# EAGLE design openSX70_WIP_NEW_LAYOUT_20171229_V30_manually-routed-AR (EAGLE 8.5.1)
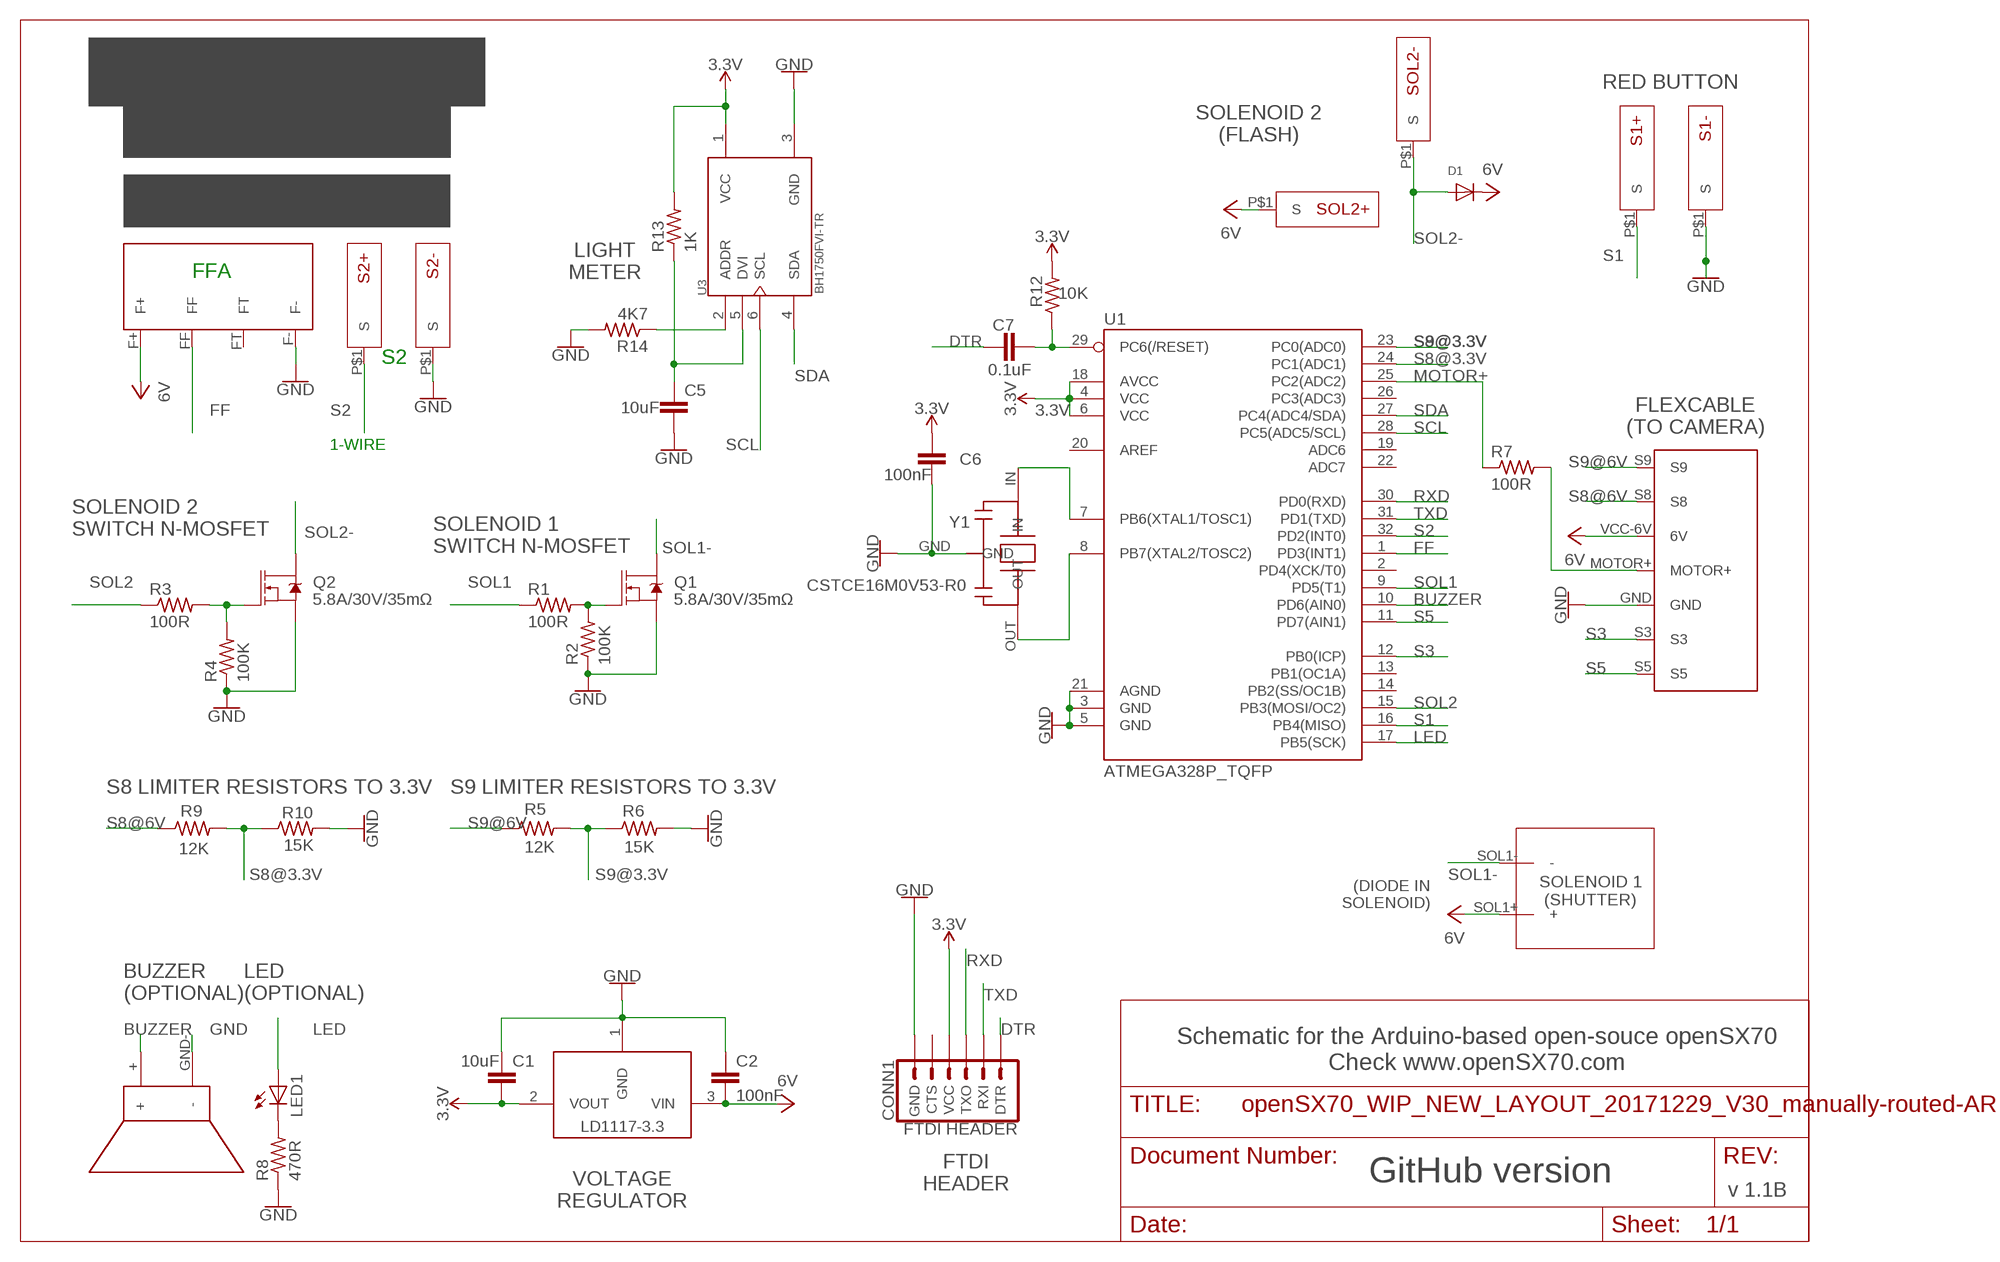
[diagram p0: schematic, sheet 1]

## Parts
BUZZ1  CSET8-5G  [CSET8-5G_PACKAGE]
C1  10uF  10UF-0603-6.3V-20%  [0603]
C2  100nF  C-EUC0603K  [C0603K]
C5  10uF  10UF-0603-6.3V-20%  [0603]
C6  100nF  C-EUC0805  [C0805]
C7  0.1uF  0.1UF-0603-25V-(+80/-20%)  [0603]
CONN1  FTDI HEADER  6_PIN_SERIAL_TARGET  [1X06]
D1  DIODESOD-523  [SOD-523]
LD11173.3V  LD1117 3.3V  LD1117-3.3  [SOT223]
LED1  LEDCHIPLED_0805  [CHIPLED_0805]
Q1  5.8A/30V/35mΩ  MOSFET-NCH-AO3404A  [SOT23-3]
Q2  5.8A/30V/35mΩ  MOSFET-NCH-AO3404A  [SOT23-3]
R1  100R  R-US_R0603  [R0603]
R2  100K  R-US_R0603  [R0603]
R3  100R  R-US_R0603  [R0603]
R4  100K  R-US_R0603  [R0603]
R5  12K  R-US_R0603  [R0603]
R6  15K  R-US_R0603  [R0603]
R7  100R  R-US_R0603  [R0603]
R8  470R  R-US_R0603  [R0603]
R9  12K  R-US_R0603  [R0603]
R10  15K  R-US_R0603  [R0603]
R12  10K  R-US_R0603  [R0603]
R13  1K  R-US_R0603  [R0603]
R14  4K7  R-US_R0603  [R0603]
S1+  SX70_S-PAD  [SX70-S-PAD]
S1-  SX70_S-PAD  [SX70-S-PAD]
S2+  SX70_S-PAD  [SX70-S-PAD]
S2-  SX70_S-PAD  [SX70-S-PAD]
SOL1  SX70-SOLENOID1-2PADS  [SX70-SOLENOID1-2]
SOL2+  SX70_S-PAD  [SX70-S-PAD]
SOL2-  SX70_S-PAD  [SX70-S-PAD]
U1  ATMEGA328P_TQFP  [TQFP32-08]
U3  BH1750FVI-TR  [SOTFL50P300X75-6N]
U$1  SX70-7-PAD  [SX70-7-PAD]
U$2  FFA  SX70-FFA-PAD  [FFA-PAD-PACKAGE]
Y1  CSTCE16M0V53-R0  [CFP95P160X100-3N]

## Nets
3.3V: C1.2 C6.1 CONN1.4(VCC) LD11173.3V.2(VOUT) R12.2 R13.2 U1.4(VCC) U1.6(VCC) U1.18(AVCC) U3.1(VCC)
6V: C2.2 D1.K(C) LD11173.3V.3(VIN) SOL1.SOL1+(+) SOL2+.P$1(S) U$1.VCC-6V(6V) U$2.F+
BUZZER: BUZZ1.+ U1.10(PD6(AIN0))
DTR: C7.1 CONN1.1(DTR)
FF: U1.1(PD3(INT1)) U$2.FF
GND: BUZZ1.GND-(-) C1.1 C2.1 C5.2 C6.2 CONN1.6(GND) LD11173.3V.1(GND) Q1.2(S) Q2.2(S) R2.1 R4.1 R6.2 R8.1 R10.2 R14.2 S1-.P$1(S) S2-.P$1(S) U1.3(GND) U1.5(GND) U1.21(AGND) U3.3(GND) U$1.GND U$2.F- Y1.GND
LED: LED1.A U1.17(PB5(SCK))
MOTOR+: R7.1 U1.25(PC2(ADC2))
MOTOR-HEADER: R7.2 U$1.MOTOR+
N$1: Q1.1(G) R1.2 R2.2
N$2: C5.1 R13.1 U3.5(DVI)
N$3: Q2.1(G) R3.2 R4.2
N$4: U1.7(PB6(XTAL1/TOSC1)) Y1.IN
N$5: LED1.C R8.2
N$6: U1.8(PB7(XTAL2/TOSC2)) Y1.OUT
N$9: C7.2 R12.1 U1.29(PC6(/RESET))
N$10: R14.1 U3.2(ADDR)
RXD: CONN1.3(TXO) U1.30(PD0(RXD))
S1: S1+.P$1(S) U1.16(PB4(MISO))
S2: S2+.P$1(S) U1.32(PD2(INT0))
S3: U1.12(PB0(ICP)) U$1.S3
S5: U1.11(PD7(AIN1)) U$1.S5
S8@3.3V: R9.2 R10.1 U1.24(PC1(ADC1))
S8@6V: R9.1 U$1.S8
S9@3.3V: R5.2 R6.1 U1.23(PC0(ADC0))
S9@6V: R5.1 U$1.S9
SCL: U1.28(PC5(ADC5/SCL)) U3.6(SCL)
SDA: U1.27(PC4(ADC4/SDA)) U3.4(SDA)
SOL1: R1.1 U1.9(PD5(T1))
SOL1-: Q1.3(D) SOL1.SOL1-(-)
SOL2: R3.1 U1.15(PB3(MOSI/OC2))
SOL2-: D1.A Q2.3(D) SOL2-.P$1(S)
TXD: CONN1.2(RXI) U1.31(PD1(TXD))
Unconnected: CONN1.5(CTS) U1.2(PD4(XCK/T0)) U1.13(PB1(OC1A)) U1.14(PB2(SS/OC1B)) U1.19(ADC6) U1.20(AREF) U1.22(ADC7) U1.26(PC3(ADC3)) U$2.FT

## Notes on the sheet
- RED BUTTON
- openSX70 DONGLE
  or
  FLASH
- SOLENOID 2
  (FLASH)
- SX70 DISTRIBUTOR
- LIGHT
  METER
- FFA
- S2
- FLEXCABLE
  (TO CAMERA)
- 1-WIRE
- SOLENOID 2
  SWITCH N-MOSFET
- SOLENOID 1
  SWITCH N-MOSFET
- S8 LIMITER RESISTORS TO 3.3V | S9 LIMITER RESISTORS TO 3.3V
- (DIODE IN
  SOLENOID)
- SOLENOID 1
  (SHUTTER)
- BUZZER
  (OPTIONAL)
- LED
  (OPTIONAL)
- Schematic for the Arduino-based open-souce openSX70
  Check www.openSX70.com
- FTDI
  HEADER
- GitHub version
- VOLTAGE
  REGULATOR
- v 1.1B

## Library data of the parts
BUZZ1 = CSET8-5G_B:CSET8-5G
C1 C5 = SparkFun-Capacitors:10UF: 10.0µF ceramic capacitors A capacitor is a passive two-terminal electrical component used to store electrical energy temporarily in an electric field.; PROD_ID: CAP-11015
C2 = rcl:C-EU: CAPACITOR, European symbol; SPICEPREFIX: C
C6 = resistor:C-EU: CAPACITOR, European symbol
C7 = SparkFun-Capacitors:0.1UF: 0.1µF ceramic capacitors A capacitor is a passive two-terminal electrical component used to store electrical energy temporarily in an electric field.; PROD_ID: CAP-00810
CONN1 = SparkFun-Connectors:6_PIN_SERIAL_TARGET: 6-pin header connection for use with the "FTDI BASIC" pinout - TARGET SIDE. Also known as "Arduino Serial Program Header". It is used to mate with our FTDI Basic serial programmers using the Arduino IDE. Note, this device has "TARGET" in the name. It is intended to be used on a design that contains a target micro-controller that you wish to program. The "sister" device, named "CABLE" is inteneded to be used on a design that usually lives on the end of your USB cable and prvides the converter chip (FTDI232 or FTDI231x) to commnicate serial RX/TX. You can populate with some of these: Break Away Headers - Straight <https://www.sparkfun.com/products/116> (PRT-00116) For reference (or to suit your programming needs) check out these designs: SparkFun FTDI Basic Breakout - 5V <https://www.sparkfun.com/products/9716> (DEV-09716) SparkFun FTDI Basic Breakout - 3.3V <https://www.sparkfun.com/products/9873> (DEV-09873) SparkFun FTDI SmartBasic <https://www.sparkfun.com/products/12935> (DEV-12935) SparkFun Beefy 3 - FTDI Basic Breakout <https://www.sparkfun.com/products/13746> (DEV-13746)
D1 = adafruit:DIODE: Diode SMADIODE - SMA Surface Mount Package 20V 1A Schottky Diode Digikey: 641-1014-6-ND DO-1N4148 - Through Hole Small Current Diode SOD-123 20V 1 A (.5mV Vf) Schottky Diode - Digikey: MBRX120TPMSCT-ND SOD-323 10V 570mA (.38mV Vf, 3ns) Schottky Diode - Digikey: ZLLS410CT-ND SOD-523 30V 30mA Schottky Diode (RB751S-40TE61) - Digikey: RB751S-40TE61CT-ND SOT23-R/W - SOT23 Package (R = Solder Paste/Reflow Ovens, W = Hand-Soldering) BAT54Film 40V 300mA - Digikey: 497-7162-1-ND
LD11173.3V = openSX70:LD1117-3.3; AVAILABILITY: Unavailable; DESCRIPTION: Sot223/Pkg 1-Amp 5-Volt Low Drop Out Voltage Regulatator; MF: Advanced Monolithic Systems; MP: AMS1117-5.0; PACKAGE: None; PRICE: None
LED1 = led:LED: LED OSRAM: - CHIPLED LG R971, LG N971, LY N971, LG Q971, LY Q971, LO R971, LY R971 LH N974, LH R974 LS Q976, LO Q976, LY Q976 LO Q996 - Hyper CHIPLED LW Q18S LB Q993, LB Q99A, LB R99A - SideLED LS A670, LO A670, LY A670, LG A670, LP A670 LB A673, LV A673, LT A673, LW A673 LH A674 LY A675 LS A676, LA A676, LO A676, LY A676, LW A676 LS A679, LY A679, LG A679 - Hyper Micro SIDELED® LS Y876, LA Y876, LO Y876, LY Y876 LT Y87S - SmartLED LW L88C, LW L88S LB L89C, LB L89S, LG L890 LS L89K, LO L89K, LY L89K LS L896, LA L896, LO L896, LY L896 - TOPLED LS T670, LO T670, LY T670, LG T670, LP T670 LSG T670, LSP T670, LSY T670, LOP T670, LYG T670 LG T671, LOG T671, LSG T671 LB T673, LV T673, LT T673, LW T673 LH T674 LS T676, LA T676, LO T676, LY T676, LB T676, LH T676, LSB T676, LW T676 LB T67C, LV T67C, LT T67C, LS T67K, LO T67K, LY T67K, LW E67C LS E67B, LA E67B, LO E67B, LY E67B, LB E67C, LV E67C, LT E67C LW T67C LS T679, LY T679, LG T679 LS T770, LO T770, LY T770, LG T770, LP T770 LB T773, LV T773, LT T773, LW T773 LH T774 LS E675, LA E675, LY E675, LS T675 LS T776, LA T776, LO T776, LY T776, LB T776 LHGB T686 LT T68C, LB T68C - Hyper Mini TOPLED® LB M676 - Mini TOPLED Santana® LG M470 LS M47K, LO M47K, LY M47K Source: http://www.osram.convergy.de LUXEON: - LUMILED® LXK2-PW12-R00, LXK2-PW12-S00, LXK2-PW14-U00, LXK2-PW14-V00 LXK2-PM12-R00, LXK2-PM12-S00, LXK2-PM14-U00 LXK2-PE12-Q00, LXK2-PE12-R00, LXK2-PE12-S00, LXK2-PE14-T00, LXK2-PE14-U00 LXK2-PB12-K00, LXK2-PB12-L00, LXK2-PB12-M00, LXK2-PB14-N00, LXK2-PB14-P00, LXK2-PB14-Q00 LXK2-PR12-L00, LXK2-PR12-M00, LXK2-PR14-Q00, LXK2-PR14-R00 LXK2-PD12-Q00, LXK2-PD12-R00, LXK2-PD12-S00 LXK2-PH12-R00, LXK2-PH12-S00 LXK2-PL12-P00, LXK2-PL12-Q00, LXK2-PL12-R00 Source: www.luxeon.com KINGBRIGHT: KA-3528ASYC Source: www.kingbright.com
Q1 Q2 = openSX70:MOSFET-NCH: N-channel MOSFETs Voltage controlled devices that allow control of high current outputs. SparkFun Products: SparkFun OpenScale <https://www.sparkfun.com/products/13261> SparkFun Digital Sandbox <https://www.sparkfun.com/products/12651> SparkFun Monster Moto Shield <https://www.sparkfun.com/products/10182> SparkFun MOSFET Power Controller <https://www.sparkfun.com/products/11214>; PROD_ID: TRANS-12988
R1-R10 R12-R14 = resistor:R-US_: RESISTOR, American symbol
S1+ S1- S2+ S2- SOL2+ SOL2- = openSX70:SX70_S-PAD
SOL1 = openSX70:SX70-SOLENOID1-2PADS
U1 = openSX70:ATMEGA328P_TQFP: Popular 328P in QFP Storefront component: ATmega328 - TQFP <https://www.sparkfun.com/products/13448> (COM-13448) Datasheet <http://www.sparkfun.com/datasheets/Components/SMD/ATMega328.pdf> SparkFun Products SparkFun RedBoard - Programmed with Arduino <https://www.sparkfun.com/products/12757> (DEV-12757) Arduino Pro Mini 328 - 5V/16MHz <https://www.sparkfun.com/products/11113> (DEV-11113) Arduino Pro Mini 328 - 3.3V/8MHz <https://www.sparkfun.com/products/11114> (DEV-11114) SparkFun OpenLog <https://www.sparkfun.com/products/13712> (DEV-13712) SparkFun MicroView - OLED Arduino Module <https://www.sparkfun.com/products/12923> (DEV-12923) SparkFun Digital Sandbox <https://www.sparkfun.com/products/12651> (DEV-12651) SparkFun PicoBoard <https://www.sparkfun.com/products/11888> (WIG-11888) Arduino Fio <https://www.sparkfun.com/products/10116> (DEV-10116) LilyPad Arduino 328 Main Board <https://www.sparkfun.com/products/13342> (DEV-13342) SparkFun RedStick <https://www.sparkfun.com/products/13741> (DEV-13741) LilyPad MP3 <https://www.sparkfun.com/products/11013> (DEV-11013) LilyPad Arduino SimpleSnap <https://www.sparkfun.com/products/10941> (DEV-10941) SparkFun Stepoko <https://www.sparkfun.com/products/13899> (ROB-13899) SparkFun Geiger Counter <https://www.sparkfun.com/products/11345> (SEN-11345) SparkFun EL Sequencer <https://www.sparkfun.com/products/12781> (COM-12781) Arduino Pro 328 - 5V/16MHz <https://www.sparkfun.com/products/10915> (DEV-10915) CryptoCape <https://www.sparkfun.com/products/12773> (DEV-12773) SparkFun IR Thermometer Evaluation Board - MLX90614 <https://www.sparkfun.com/products/10740> (SEN-10740) SparkFun RedBot Mainboard <https://www.sparkfun.com/products/12097> (ROB-12097) Arduino Pro 328 - 3.3V/8MHz <https://www.sparkfun.com/products/10914> (DEV-10914) SparkFun Block for Intel® Edison - Arduino <https://www.sparkfun.com/products/13036> (DEV-13036) SparkFun Simon Says - Surface Mount Soldering Kit <https://www.sparkfun.com/products/10935> (KIT-10935) SparkFun 7-Segment Serial Display - Red <https://www.sparkfun.com/products/11441> (COM-11441) SparkFun 7-Segment Serial Display - White <https://www.sparkfun.com/products/11629> (COM-11629) SparkFun 7-Segment Serial Display - Yellow <https://www.sparkfun.com/products/11443> (COM-11443) SparkFun 7-Segment Serial Display - Kelly Green <https://www.sparkfun.com/products/11440> (COM-11440) SparkFun 7-Segment Serial Display - Blue <https://www.sparkfun.com/products/11442> (COM-11442) SparkFun OpenSegment Serial Display - 20mm (Blue) <https://www.sparkfun.com/products/11647> (COM-11647) SparkFun OpenSegment Serial Display - 20mm (Green) <https://www.sparkfun.com/products/11646> (COM-11646) SparkFun OpenSegment Serial Display - 20mm (White) <https://www.sparkfun.com/products/11648> (COM-11648) SparkFun OpenSegment Serial Display - 20mm (Red) <https://www.sparkfun.com/products/11644> (COM-11644) SparkFun OpenSegment Serial Display - 20mm (Yellow) <https://www.sparkfun.com/products/11645> (COM-11645) SparkFun OpenSegment Shield <https://www.sparkfun.com/products/13190> (DEV-13190); PROD_ID: IC-09069
U3 = openSX70:BH1750FVI-TR: Light to Digital Ambient Light Sensor Digital O/P 1lux to 65535lux 6-Pin WSOF Embossed T/R; AVAILABILITY: Good; DESCRIPTION: Light to Digital Ambient Light Sensor Digital O/P 1lux to 65535lux 6-Pin WSOF Embossed T/R; MF: Rohm; MP: BH1750FVI-TR; PACKAGE: SMD-6 Rohm; PRICE: 2.38 USD
U$1 = openSX70:SX70-7-PAD
U$2 = openSX70:SX70-FFA-PAD
Y1 = CSTCE16M0V53-R0:CSTCE16M0V53-R0: Ceramic Resonator 16MHz ±0.5% (Tol) ±0.3% (Stability) 15pF 40Ohm 3-Pin CSMD T/R; AVAILABILITY: Good; DESCRIPTION: Ceramic Resonator 16MHz ??0.5% (Tol) ??0.3% (Stability) 15pF 40Ohm 3-Pin CSMD T/R; MF: Murata; MP: CSTCE16M0V53-R0; PACKAGE: SMD-3 Murata; PRICE: 0.28 USD

## Board
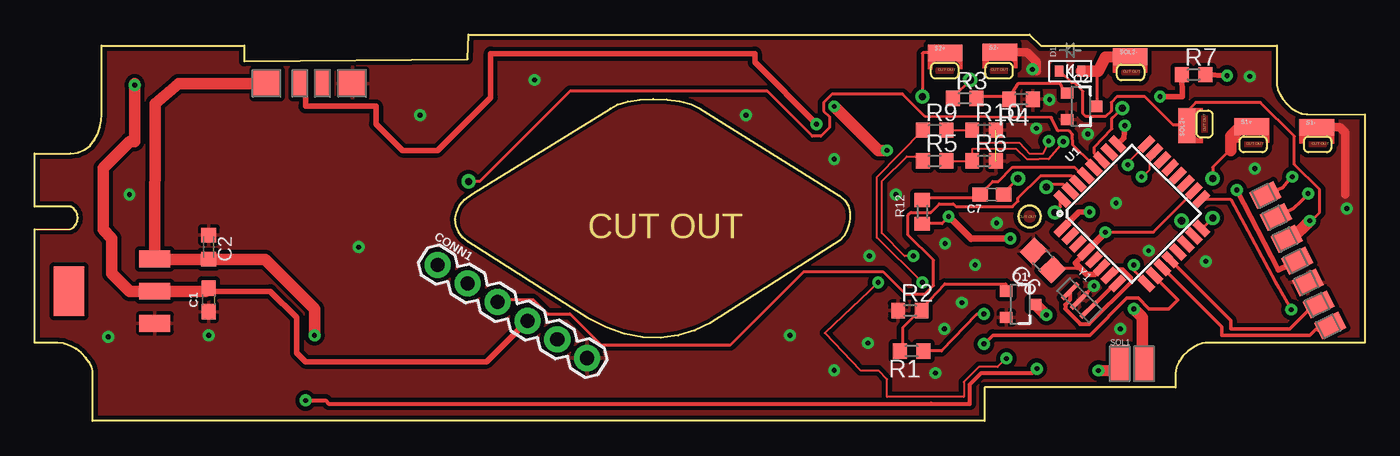
[diagram p1: board, top side]
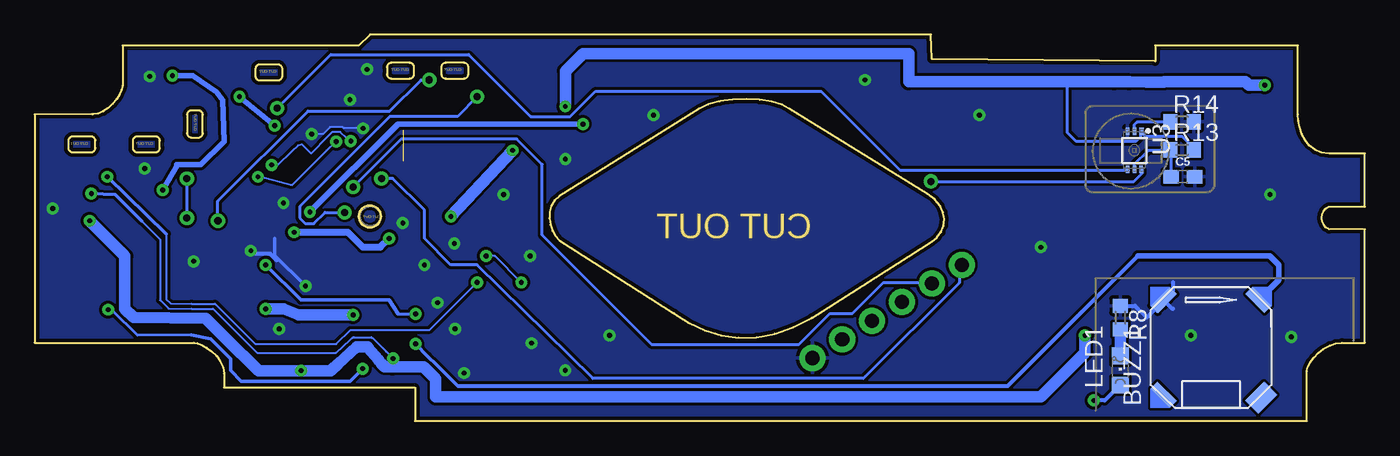
[diagram p2: board, bottom side, seen from below]

Size 95.88 x 27.86 mm. Coordinates in mm from the lower left corner, seen from the top.
Outline: 71.72,15.54 71.88,15.53 72.03,15.48 72.17,15.41 72.29,15.31
Outline: 72.29,15.31 72.39,15.19 72.46,15.06 72.51,14.91 72.52,14.74
Outline: 72.52,14.74 72.51,14.58 72.46,14.43 72.39,14.3 72.29,14.18
Outline: 72.29,14.18 72.17,14.08 72.03,14.01 71.88,13.96 71.72,13.94
Outline: 71.72,13.94 71.56,13.96 71.41,14.01 71.28,14.08 71.16,14.18
Outline: 71.16,14.18 71.06,14.3 70.99,14.43 70.94,14.58 70.92,14.74
Outline: 70.92,14.74 70.94,14.91 70.99,15.06 71.06,15.19 71.16,15.31
Outline: 71.16,15.31 71.28,15.41 71.41,15.48 71.56,15.53 71.72,15.54
Outline: 71.72,15.54 71.57,15.53 71.42,15.48 71.28,15.41 71.16,15.31
Outline: 71.16,15.31 71.06,15.19 70.98,15.05 70.94,14.9 70.92,14.74
Outline: 70.92,14.74 70.94,14.59 70.98,14.44 71.06,14.3 71.16,14.18
Outline: 71.16,14.18 71.28,14.08 71.42,14.01 71.57,13.96 71.72,13.94
Outline: 71.72,13.94 71.88,13.96 72.03,14.01 72.17,14.08 72.29,14.18
Outline: 72.29,14.18 72.39,14.3 72.46,14.44 72.51,14.59 72.52,14.74
Outline: 72.52,14.74 72.51,14.9 72.46,15.05 72.39,15.19 72.29,15.31
Outline: 72.29,15.31 72.17,15.41 72.03,15.48 71.88,15.53 71.72,15.54
Outline: 91.7,22.11 91.77,22.11 95.88,22.11 95.88,5.64 84.4,5.64 84.15,5.6 83.83,5.47 83.48,5.27 83.11,5.01 82.78,4.68 82.5,4.3 82.31,3.87 82.24,3.4 82.24,2.41 68.47,2.41 68.47,0 4.17,0 4.17,3.6 4.11,3.9 3.94,4.23 3.69,4.56 3.36,4.89 2.98,5.18 2.56,5.42 2.11,5.58 1.66,5.64 0,5.64 0,13.82 2.59,13.84 2.81,13.96 2.98,14.15 3.07,14.39 3.1,14.65 3.07,14.91 2.97,15.15 2.81,15.34 2.59,15.45 0,15.46 0,19.29 2.59,19.29 3.14,19.36 3.6,19.56 3.99,19.87 4.3,20.26 4.53,20.7 4.7,21.17 4.79,21.65 4.82,22.11 4.82,27.07 15.1,27.07 15.1,25.94 31.21,26.11 31.28,27.86 71.71,27.86 72.52,27.07 89.55,27.07 89.55,24.21 89.61,23.9 89.76,23.56 89.97,23.21 90.25,22.87 90.57,22.57 90.93,22.33 91.31,22.17 91.7,22.11
Outline: 83.76,20.77 83.76,22.06 83.77,22.12 83.79,22.19 83.82,22.24 83.86,22.29 83.91,22.33 83.96,22.36 84.03,22.38 84.09,22.39 84.57,22.39 84.64,22.38 84.7,22.36 84.76,22.33 84.81,22.29 84.85,22.24 84.88,22.19 84.9,22.12 84.9,22.06 84.9,20.77 84.9,20.7 84.88,20.64 84.85,20.58 84.81,20.53 84.76,20.49 84.7,20.46 84.64,20.44 84.57,20.44 84.09,20.44 84.03,20.44 83.96,20.46 83.91,20.49 83.86,20.53 83.82,20.58 83.79,20.64 83.77,20.7 83.76,20.77
Outline: 87.19,20.53 88.48,20.53 88.54,20.52 88.61,20.5 88.66,20.47 88.71,20.43 88.75,20.38 88.78,20.32 88.8,20.26 88.81,20.19 88.81,19.71 88.8,19.65 88.78,19.59 88.75,19.53 88.71,19.48 88.66,19.44 88.61,19.41 88.54,19.39 88.48,19.38 87.19,19.38 87.12,19.39 87.06,19.41 87,19.44 86.95,19.48 86.91,19.53 86.88,19.59 86.86,19.65 86.86,19.71 86.86,20.19 86.86,20.26 86.88,20.32 86.91,20.38 86.95,20.43 87,20.47 87.06,20.5 87.12,20.52 87.19,20.53
Outline: 91.84,20.53 93.13,20.53 93.2,20.52 93.26,20.5 93.32,20.47 93.37,20.43 93.41,20.38 93.44,20.32 93.46,20.26 93.46,20.19 93.46,19.71 93.46,19.65 93.44,19.59 93.41,19.53 93.37,19.48 93.32,19.44 93.26,19.41 93.2,19.39 93.13,19.38 91.84,19.38 91.78,19.39 91.71,19.41 91.66,19.44 91.61,19.48 91.57,19.53 91.54,19.59 91.52,19.65 91.51,19.71 91.51,20.19 91.52,20.26 91.54,20.32 91.57,20.38 91.61,20.43 91.66,20.47 91.71,20.5 91.78,20.52 91.84,20.53
Outline: 78.36,25.71 79.65,25.71 79.71,25.7 79.78,25.68 79.83,25.65 79.88,25.61 79.92,25.56 79.95,25.5 79.97,25.44 79.98,25.37 79.98,24.9 79.97,24.83 79.95,24.77 79.92,24.71 79.88,24.66 79.83,24.62 79.78,24.59 79.71,24.57 79.65,24.56 78.36,24.56 78.29,24.57 78.23,24.59 78.17,24.62 78.12,24.66 78.08,24.71 78.05,24.77 78.03,24.83 78.02,24.9 78.02,25.37 78.03,25.44 78.05,25.5 78.08,25.56 78.12,25.61 78.17,25.65 78.23,25.68 78.29,25.7 78.36,25.71
Outline: 68.87,25.84 70.16,25.84 70.23,25.83 70.29,25.81 70.35,25.78 70.39,25.74 70.43,25.69 70.47,25.63 70.49,25.57 70.49,25.51 70.49,25.03 70.49,24.96 70.47,24.9 70.43,24.84 70.39,24.79 70.35,24.75 70.29,24.72 70.23,24.7 70.16,24.69 68.87,24.69 68.8,24.7 68.74,24.72 68.68,24.75 68.64,24.79 68.59,24.84 68.56,24.9 68.54,24.96 68.54,25.03 68.54,25.51 68.54,25.57 68.56,25.63 68.59,25.69 68.64,25.74 68.68,25.78 68.74,25.81 68.8,25.83 68.87,25.84
Outline: 64.95,25.84 66.24,25.84 66.31,25.83 66.37,25.81 66.43,25.78 66.48,25.74 66.52,25.69 66.55,25.63 66.57,25.57 66.57,25.51 66.57,25.03 66.57,24.96 66.55,24.9 66.52,24.84 66.48,24.79 66.43,24.75 66.37,24.72 66.31,24.7 66.24,24.69 64.95,24.69 64.88,24.7 64.82,24.72 64.77,24.75 64.72,24.79 64.68,24.84 64.65,24.9 64.63,24.96 64.62,25.03 64.62,25.51 64.63,25.57 64.65,25.63 64.68,25.69 64.72,25.74 64.77,25.78 64.82,25.81 64.88,25.83 64.95,25.84
Outline: 31.52,16.35 41.5,22.53 42.01,22.82 42.74,23.03 43.62,23.16 44.59,23.21 45.57,23.18 46.5,23.06 47.32,22.84 47.95,22.53 58.05,16.23 58.41,15.9 58.64,15.51 58.76,15.07 58.78,14.61 58.71,14.16 58.56,13.73 58.34,13.34 58.06,13.03 49.78,7.77 48.71,7.05 47.57,6.51 46.38,6.16 45.13,5.99 43.84,6.03 42.53,6.28 41.2,6.75 39.87,7.45 31.22,12.93 30.83,13.23 30.55,13.62 30.37,14.06 30.32,14.55 30.4,15.04 30.62,15.52 30.99,15.97 31.52,16.35
Copper layers (1*16): Top 0.035mm / dielectric 1.5mm / Bottom 0.035mm
Design rules "SparkFun": minimum track width 8mil, minimum drill 20mil, track to track 8mil, track to pad 8mil, pad to pad 8mil, via to via 8mil, smd to smd 8mil, copper to edge 10mil, drill to drill 8mil, minimum pad ring 12mil, minimum via ring 10mil, stop-mask expansion 4mil, vias tented up to drill 25mil, thermal gap 10mil

### Footprints (pad centres in the part's own frame; a part is rotated, then mirrored left to right if it is on the bottom)
CSET8-5G_PACKAGE = smd 1.9 x 0.7 rotated 225: + 3.054,-3.114 | smd 1.9 x 0.7 rotated 45: DUMMY1 -3.786,3.746 | smd 1.9 x 1.3 rotated 135: DUMMY2 -3.99,-3.29 | smd 1.9 x 0.7 rotated 315: GND- 3.051,3.742
0603 = smd 1.1 x 1: 1 -0.85,0; 2 0.85,0
C0603K = smd 1.05 x 1.08: 1 -0.875,0; 2 0.875,0
C0805 = smd 1.3 x 1.5: 1 -0.95,0; 2 0.95,0
1X06 = drill 1.016 pad 1.88: 1 0,0; 2 2.54,0; 3 5.08,0; 4 7.62,0; 5 10.16,0; 6 12.7,0
SOD-523 = smd 0.8 x 0.6: A 0,-0.8; K 0,0.8
SOT223 = smd 2.235 x 1.219: 1 -3.099,2.311; 2 -3.099,0; 3 -3.099,-2.311 | smd 2.2 x 3.6: 4 3.099,0
CHIPLED_0805 = smd 1.2 x 1.2: A 0,-1.05; C 0,1.05
SOT23-3 = smd 0.8 x 0.9: 1 -0.95,-1; 2 0.95,-1; 3 0,1.1
R0603 = smd 1 x 1.1: 1 -0.85,0; 2 0.85,0
SX70-S-PAD = smd 2.489 x 1.194: P$1 0.01,0.087
SX70-SOLENOID1-2 = smd 1.372 x 2.54: SOL1+ -0.826,0.127; SOL1- 0.953,0.127
TQFP32-08 = smd 1.27 x 0.559: 1 -4.293,2.8; 2 -4.293,2; 3 -4.293,1.2; 4 -4.293,0.4; 5 -4.293,-0.4; 6 -4.293,-1.2; 7 -4.293,-2; 8 -4.293,-2.8; 17 4.293,-2.8; 18 4.293,-2; 19 4.293,-1.2; 20 4.293,-0.4; 21 4.293,0.4; 22 4.293,1.2; 23 4.293,2; 24 4.293,2.8 | smd 0.559 x 1.27: 9 -2.8,-4.293; 10 -2,-4.293; 11 -1.2,-4.293; 12 -0.4,-4.293; 13 0.4,-4.293; 14 1.2,-4.293; 15 2,-4.293; 16 2.8,-4.293; 25 2.8,4.293; 26 2,4.293; 27 1.2,4.293; 28 0.4,4.293; 29 -0.4,4.293; 30 -1.2,4.293; 31 -2,4.293; 32 -2.8,4.293
SOTFL50P300X75-6N = smd 0.55 x 0.3: 1 -1.375,0.525 | smd 0.55 x 0.25: 2 -1.375,0; 3 -1.375,-0.5; 4 1.375,-0.5; 5 1.375,0; 6 1.375,0.5
SX70-7-PAD = smd 1.31 x 1.93 rotated 296: GND 3.404,0.495; MOTOR+ 2.654,2.07; S3 4.204,-1.067; S5 5.016,-2.591; S8 0.356,6.807; S9 1.118,5.232; VCC-6V 1.88,3.658
FFA-PAD-PACKAGE = smd 1.95 x 1.95: F+ -3.277,-0.013; F- 2.87,0 | smd 1.05 x 1.95: FF -0.914,0; FT 0.737,0.025
CFP95P160X100-3N = smd 0.3 x 1.6: GND 0.038,0.175; IN -0.912,0.177; OUT 0.992,0.174

### Placement (x,y rotation side)
BUZZ1  10.77,5.67 90 bottom
C1  12.55,8.72 90 top
C2  12.55,12.53 270 top
C5  13.12,17.61 0 bottom
C6  72.68,11.58 135 top
C7  69,16.34 180 top
CONN1  29.06,11.26 328 top
D1  74.65,25.23 90 top
LD11173.3V  5.56,9.36 180 top
LED1  17.63,3.64 0 bottom
Q1  71.03,8.4 270 top
Q2  75.41,22.69 270 top
R1  63.22,5.04 180 top
R2  63.09,7.96 0 top
R3  67.03,23.26 0 top
R4  71.09,23.2 180 top
R5  64.87,18.75 0 top
R6  68.43,18.75 0 top
R7  83.54,24.98 0 top
R8  17.63,7.45 270 bottom
R9  64.87,20.98 0 top
R10  68.43,20.98 0 top
R12  63.98,15.07 270 top
R13  13.18,19.55 0 bottom
R14  13.18,21.58 0 bottom
S1+  87.72,21.14 0 top
S1-  92.42,21.09 0 top
S2+  65.62,26.46 0 top
S2-  69.56,26.51 0 top
SOL1  79.03,4.05 0 top
SOL2+  83.14,21.28 90 top
SOL2-  78.96,26.19 0 top
U1  79.09,14.94 45 top
U3  16.61,19.52 270 bottom
U$1  88.37,9.48 0 top
U$2  20.04,24.34 0 top
Y1  75.16,8.59 315 top

### Tracks (layer width: path | path; a pad name or v marks a point on that pad's centre or on a via)
3.3V  (via drill 0.35)
  Top 0.203: R12.2 65.4,14.23 65.81,14.64 v65.89,14.75 | U1.18 83.49,16.47 80.64,13.62 77.39,13.62 v77.19,13.61 | C6.1 73.53,10.98 75.16,10.98 75.3,11.12
  Top 0.406: U1.4 75.03,11.39 75.3,11.12 75.86,10.56 76.41,10.56 U1.6 | LD11173.3V.2 16.99,9.36 18.9,7.45 18.9,4.91 19.53,4.28 32.57,4.28 CONN1.4
  Top 0.508: U1.4 v77.19,13.6 v77.19,13.61 | v65.89,14.75 67.51,13.13 v70.33,13.17
  Top 0.813: 7.21,24.34 v7.21,24.21 7.21,20.15 6.83,20.15 4.93,18.25 4.93,13.8 5.56,13.17 5.56,10.63 6.83,9.36 LD11173.3V.2 12.33,9.36 C1.2 | v57.63,22.69 60.81,19.52 v61.44,19.52
  Bottom 0.203: 21.44,24.47 21.44,20.79 20.8,20.15 16.52,20.15 16.18,20.49 16.18,20.8 U3.1 16.03,20.73 15.82,20.53 13.18,20.53 12.37,19.72 R13.2
  Bottom 0.508: v77.19,13.61 73.32,13.61 72.24,12.53 70.97,12.53 v70.33,13.17
  Bottom 0.813: v7.21,24.21 8.36,24.21 8.61,24.47 14.46,24.47 14.48,24.44 14.49,24.44 14.5,24.44 15.11,24.44 15.72,24.44 16.99,24.46 18.09,24.47 21.44,24.47 32.87,24.47 32.87,26.5 56.36,26.5 57.63,25.23 v57.63,22.69 | v61.44,19.52 v65.89,14.75
6V  (via drill 0.35)
  Top 0.203: D1.K 73.94,25.21 74.75,24.39 74.95,24.39 75.56,23.78 75.56,22.16 75.77,21.95 77.19,21.95 77.6,22.36 77.6,22.97 78,23.38 80.03,23.38 82.07,21.34 82.88,21.34 SOL2+.P$1 83.08,21.34 83.08,22.36 83.69,22.97 88.37,22.97 90.8,20.53 90.8,18.5 92.63,16.67 92.63,15.05 92.23,14.64 v91.92,14.44
  Top 0.61: U$1.VCC-6V 90.63,13.14
  Top 0.813: 90.63,13.14 v91.92,14.44 | U$2.F+ 10.39,24.34 8.67,22.88 LD11173.3V.3 C2.2 16.6,11.66 20.17,8.09 v20.17,6.18 | v76.68,3.63 77.95,3.64 SOL1.SOL1+
  Bottom 0.813: v91.92,14.44 89.38,11.9 89.38,8.09 88.75,7.45 83.54,7.39 82.14,5.99 79.73,3.6 76.68,3.6 | v20.17,6.18 20.17,4.91 23.34,1.74 66.97,1.74 66.97,3.03 67.85,3.91 70.05,3.91 70.08,3.88 70.36,3.91 70.65,3.91 70.67,3.93 70.71,3.94 70.89,4.15 71.09,4.35 71.09,4.39 71.87,5.32 71.88,5.33 72.68,5.33 74.01,4.12 74.22,3.91 74.24,3.91 | 74.24,3.91 74.26,3.89 74.55,3.6 76.68,3.6 | 74.24,3.91 74.26,3.89 | 76.68,3.6 v76.68,3.63
BUZZER  (via drill 0.35)
  Top 0.254: 80.72,10.4 82.4,8.72 81.76,8.09 80.33,8.09 79.55,8.87 78.74,8.87 76.05,6.18 71.6,6.18 69.06,6.18 v68.43,5.55
  Top 0.305: 80.72,10.4 U1.10
  Bottom 0.152: 6.97,9.41 BUZZ1.+ 6.97,8.73
  Bottom 0.254: v68.43,5.55 67.55,4.67 66.9,4.03 65.36,2.5
  Bottom 0.305: 16.36,11.9 25.75,2.5 65.36,2.5
  Bottom 0.406: BUZZ1.+ 6.2,10.18 6.2,11.26 6.83,11.9 16.36,11.9
DTR  (via drill 0.51)
  Top 0.203: v70.89,17.48 69.87,16.47 C7.1
  Bottom 0.203: v70.89,17.48 70.08,17.48 67.79,15.2 67.79,13.17 65.89,11.26 63.98,11.26 55.65,3.06 36.14,3.06 29.23,9.97 29.23,11.18 CONN1.1
FF  (via drill 0.35)
  Top 0.406: U$2.FF 19.53,23.94 19.53,22.69 24.61,22.69 24.61,21.42 26.52,19.52 29.06,19.52 32.87,23.33 32.87,26.5 51.92,26.5 51.92,25.87 v56.36,21.42 | v76.05,15.07 75.26,15.07 U1.1
  Bottom 0.406: v56.36,21.42 69.7,21.42 v76.05,15.07
GND  (via drill 0.35)  (1 unrouted)
  Top 0.254: Y1.GND 76.34,9.73 v76.36,9.73
  Top 0.61: S1-.P$1 94.07,21.18 94.46,20.79 94.46,16.34 | S2-.P$1 71.51,26.59 72.24,25.87 72.24,25.23
  Bottom 0.152: BUZZ1.GND- 14.48,8.67 | v72.2,21.1 73.6,21.1 73.7,21.2 74.59,21.2 75.1,20.69 v75.92,20.69
  Bottom 0.203: 14.6,8.75 BUZZ1.GND-
  Bottom 0.254: v76.36,9.73 78.59,11.95 78.59,13.17
  Bottom 0.305: 78.44,11.58 78.44,11.59 78.9,12.05 80.07,12.05 v80.3,12.28 | R8.1 16.57,8.3 15.72,7.45 14.51,8.66 BUZZ1.GND- | BUZZ1.GND- 13.87,8.09 13.82,8.09 | BUZZ1.GND- 13.82,9.42 13.82,9.99
  other vias: 6.83,16.34 87.6,24.85 5.31,6.05 12.55,6.18 77.95,15.71 67.79,11.26 60.08,5.61 27.79,22.06 36.04,24.6 23.34,12.53 54.46,6.18 65.57,6.62 60.17,11.9 66.84,8.53 57.63,18.88 51.28,22.06 64.93,3.45 78.27,6.62 94.59,15.32 71.92,25.36 87.95,18.21 57.63,3.64 73.16,23.17 69.35,14.28 84.43,11.51 62.08,16.34 65.63,12.78
  pour Top (isolate 0.305): 91.7,22.11 91.77,22.11 95.88,22.11 95.88,5.64 84.4,5.64 84.15,5.6 83.83,5.47 83.48,5.27 83.11,5.01 82.78,4.68 82.5,4.3 82.31,3.87 82.24,3.4 82.24,2.41 68.47,2.41 68.47,0 4.17,0 4.17,3.6 4.11,3.9 3.94,4.23 3.69,4.56 3.36,4.89 2.98,5.18 2.56,5.42 2.11,5.58 1.66,5.64 0,5.64 0,13.82 2.59,13.84 2.81,13.96 2.98,14.15 3.07,14.39 3.1,14.65 3.07,14.91 2.97,15.15 2.81,15.34 2.59,15.45 0,15.46 0,19.29 2.59,19.29 3.14,19.36 3.6,19.56 3.99,19.87 4.3,20.25 4.53,20.7 4.7,21.17 4.79,21.65 4.82,22.11 4.82,27.07 15.1,27.07 15.1,25.94 31.21,26.11 31.28,27.86 71.71,27.86 72.52,27.07 89.55,27.07 89.55,24.21 89.61,23.9 89.76,23.56 89.97,23.21 90.25,22.87 90.57,22.57 90.93,22.33 91.31,22.17
  pour Bottom: 91.7,22.11 91.77,22.11 95.88,22.11 95.88,5.64 84.4,5.64 84.15,5.6 83.83,5.47 83.48,5.27 83.11,5.01 82.78,4.68 82.5,4.3 82.31,3.87 82.24,3.4 82.24,2.41 68.47,2.41 68.47,0 4.17,0 4.17,3.6 4.11,3.9 3.94,4.23 3.69,4.56 3.36,4.89 2.98,5.18 2.56,5.42 2.11,5.58 1.66,5.64 0,5.64 0,13.82 2.59,13.84 2.81,13.96 2.98,14.15 3.07,14.39 3.1,14.65 3.07,14.91 2.97,15.15 2.81,15.34 2.59,15.45 0,15.46 0,19.29 2.59,19.29 3.14,19.36 3.6,19.56 3.99,19.87 4.3,20.25 4.53,20.7 4.7,21.17 4.79,21.65 4.82,22.11 4.82,27.07 15.1,27.07 15.1,25.94 31.21,26.11 31.28,27.86 71.71,27.86 72.52,27.07 89.55,27.07 89.55,24.21 89.61,23.9 89.76,23.56 89.97,23.21 90.25,22.87 90.57,22.57 90.93,22.33 91.31,22.17
LED  (via drill 0.35)
  Top 0.203: U1.17 86.21,16 86.21,15.96 89.44,10.02 | 89.44,10.02 89.64,9.67 | 89.44,10.02 v90.59,8.02
  Top 0.305: v19.53,1.47 20.96,1.47 21.18,1.24 64.62,1.24 67.41,1.23 67.41,2.62 68.24,3.45 71.92,3.45 v72.24,3.77
  Bottom 0.203: v90.59,8.02 90.32,8.02 88.47,6.17 84.59,6.2
  Bottom 0.254: v72.24,3.77 73.14,2.87 80.99,2.87 81.76,3.64 81.76,4.47 83.18,5.92 84.59,6.2
  Bottom 0.305: LED1.A 18.75,1.47 v19.53,1.47
MOTOR+  (via drill 0.35)
  Top 0.406: U1.25 78.52,20.4 78.59,21.23 v78.59,21.29 | v81.13,23.39 82.71,23.39 R7.1
  Bottom 0.406: v78.59,21.29 v81.13,23.39
MOTOR-HEADER  (via drill 0.35)
  Top 0.406: U$1.MOTOR+ 89.64,10.88 v86.65,16.66 | v85.95,24.91 R7.2
  Bottom 0.406: 85.64,18.5 85.57,18.5 | 85.57,18.5 85.52,18.5 83.92,18.5 82.21,20.15 82.33,23.13 82.78,23.71 84.49,24.91 v85.95,24.91 | 85.57,18.5 v86.65,16.66
N$1
  Top 0.203: Q1.1 70,9.88 65.6,9.88 63.98,8.14 R2.2 63.78,7.93 62.56,6.71 62.56,5.09 R1.2
N$2
  Bottom 0.203: U3.5 16.64,18.3 16.64,18.5 15.62,19.52 14.2,19.52 R13.1 13.99,19.52 13.99,17.69 C5.1
N$3
  Top 0.203: Q2.1 74.31,23.78 74.16,23.78 73.91,24.35 70.9,24.35 70.28,23.38 R4.2 70.08,23.38 68.05,23.38 R3.2
N$4
  Top 0.305: Y1.IN 74.64,8.74 74.28,8.38 74.28,8.08 75.37,6.99 76,6.99 79.04,10.03 79.04,10.33 78.44,10.93 78.14,10.93 77.71,10.49 U1.7
N$5
  Bottom 0.813: LED1.C R8.2
N$6
  Top 0.305: Y1.OUT 77.89,9.93 U1.8
N$7
  pour Top: 71.72,15.54 71.88,15.53 72.03,15.48 72.17,15.41 72.29,15.31 72.39,15.19 72.46,15.06 72.51,14.91 72.52,14.74 72.51,14.58 72.46,14.43 72.39,14.3 72.29,14.18 72.17,14.08 72.03,14.01 71.88,13.96 71.72,13.94 71.56,13.96 71.41,14.01 71.28,14.08 71.16,14.18 71.06,14.3 70.99,14.43 70.94,14.58 70.92,14.74 70.94,14.91 70.99,15.06 71.06,15.19 71.16,15.31 71.28,15.41 71.41,15.48 71.56,15.53
N$8
  pour Top: 83.76,20.77 83.76,22.06 83.77,22.12 83.79,22.19 83.82,22.24 83.86,22.29 83.91,22.33 83.96,22.36 84.03,22.38 84.09,22.39 84.57,22.39 84.64,22.38 84.7,22.36 84.76,22.33 84.81,22.29 84.85,22.24 84.88,22.19 84.9,22.12 84.9,22.06 84.9,20.77 84.9,20.7 84.88,20.64 84.85,20.58 84.81,20.53 84.76,20.49 84.7,20.46 84.64,20.44 84.57,20.44 84.09,20.44 84.03,20.44 83.96,20.46 83.91,20.49 83.86,20.53 83.82,20.58 83.79,20.64 83.77,20.7
N$9
  Top 0.203: R12.1 63.98,16.06 67.84,16.06 68.05,16.26 C7.2 68.25,16.47 69.06,17.28 69.47,17.28 70.48,18.3 74.95,18.3 75.36,17.89 75.77,17.89 U1.29
N$10
  Bottom 0.203: U3.2 16.64,20.94 16.64,21.34 16.43,21.55 14.2,21.55 R14.1
N$11
  pour Top: 87.19,20.53 88.48,20.53 88.54,20.52 88.61,20.5 88.66,20.47 88.71,20.43 88.75,20.38 88.78,20.32 88.8,20.26 88.81,20.19 88.81,19.71 88.8,19.65 88.78,19.59 88.75,19.53 88.71,19.48 88.66,19.44 88.61,19.41 88.54,19.39 88.48,19.38 87.19,19.38 87.12,19.39 87.06,19.41 87,19.44 86.95,19.48 86.91,19.53 86.88,19.59 86.86,19.65 86.86,19.71 86.86,20.19 86.86,20.26 86.88,20.32 86.91,20.38 86.95,20.43 87,20.47 87.06,20.5 87.12,20.52
N$12
  pour Top: 91.84,20.53 93.13,20.53 93.2,20.52 93.26,20.5 93.32,20.47 93.37,20.43 93.41,20.38 93.44,20.32 93.46,20.26 93.46,20.19 93.46,19.71 93.46,19.65 93.44,19.59 93.41,19.53 93.37,19.48 93.32,19.44 93.26,19.41 93.2,19.39 93.13,19.38 91.84,19.38 91.78,19.39 91.71,19.41 91.66,19.44 91.61,19.48 91.57,19.53 91.54,19.59 91.52,19.65 91.51,19.71 91.51,20.19 91.52,20.26 91.54,20.32 91.57,20.38 91.61,20.43 91.66,20.47 91.71,20.5 91.78,20.52
N$13
  pour Top: 78.36,25.71 79.65,25.71 79.71,25.7 79.78,25.68 79.83,25.65 79.88,25.61 79.92,25.56 79.95,25.5 79.97,25.44 79.98,25.37 79.98,24.9 79.97,24.83 79.95,24.77 79.92,24.71 79.88,24.66 79.83,24.62 79.78,24.59 79.71,24.57 79.65,24.56 78.36,24.56 78.29,24.57 78.23,24.59 78.17,24.62 78.12,24.66 78.08,24.71 78.05,24.77 78.03,24.83 78.02,24.9 78.02,25.37 78.03,25.44 78.05,25.5 78.08,25.56 78.12,25.61 78.17,25.65 78.23,25.68 78.29,25.7
N$14
  pour Top: 68.87,25.84 70.16,25.84 70.23,25.83 70.29,25.81 70.35,25.78 70.39,25.74 70.44,25.69 70.47,25.63 70.49,25.57 70.49,25.5 70.49,25.03 70.49,24.96 70.47,24.9 70.44,24.84 70.39,24.79 70.35,24.75 70.29,24.72 70.23,24.7 70.16,24.69 68.87,24.69 68.8,24.7 68.74,24.72 68.69,24.75 68.64,24.79 68.6,24.84 68.56,24.9 68.55,24.96 68.54,25.03 68.54,25.5 68.55,25.57 68.56,25.63 68.6,25.69 68.64,25.74 68.69,25.78 68.74,25.81 68.8,25.83
N$16
  pour Top: 64.95,25.84 66.24,25.84 66.31,25.83 66.37,25.81 66.43,25.78 66.48,25.74 66.52,25.69 66.55,25.63 66.57,25.57 66.57,25.5 66.57,25.03 66.57,24.96 66.55,24.9 66.52,24.84 66.48,24.79 66.43,24.75 66.37,24.72 66.31,24.7 66.24,24.69 64.95,24.69 64.89,24.7 64.82,24.72 64.77,24.75 64.72,24.79 64.68,24.84 64.65,24.9 64.63,24.96 64.62,25.03 64.62,25.5 64.63,25.57 64.65,25.63 64.68,25.69 64.72,25.74 64.77,25.78 64.82,25.81 64.89,25.83
N$17
  pour Top: 31.52,16.35 41.5,22.53 42.01,22.82 42.74,23.03 43.62,23.16 44.59,23.21 45.57,23.18 46.5,23.05 47.32,22.84 47.96,22.53 58.05,16.23 58.41,15.9 58.64,15.51 58.77,15.07 58.78,14.61 58.71,14.16 58.56,13.73 58.34,13.34 58.06,13.03 49.78,7.76 48.71,7.05 47.57,6.51 46.38,6.16 45.13,5.99 43.85,6.03 42.53,6.28 41.2,6.75 39.87,7.45 31.22,12.93 30.83,13.23 30.55,13.62 30.37,14.06 30.32,14.55 30.4,15.04 30.62,15.52 30.99,15.97
N$18
  pour Bottom: 71.72,15.54 71.88,15.53 72.03,15.48 72.17,15.41 72.29,15.31 72.39,15.19 72.46,15.06 72.51,14.91 72.52,14.74 72.51,14.58 72.46,14.43 72.39,14.3 72.29,14.18 72.17,14.08 72.03,14.01 71.88,13.96 71.72,13.94 71.56,13.96 71.41,14.01 71.28,14.08 71.16,14.18 71.06,14.3 70.99,14.43 70.94,14.58 70.92,14.74 70.94,14.91 70.99,15.06 71.06,15.19 71.16,15.31 71.28,15.41 71.41,15.48 71.56,15.53
N$19
  pour Bottom: 83.76,20.77 83.76,22.06 83.77,22.12 83.79,22.19 83.82,22.24 83.86,22.29 83.91,22.33 83.96,22.36 84.03,22.38 84.09,22.39 84.57,22.39 84.64,22.38 84.7,22.36 84.76,22.33 84.81,22.29 84.85,22.24 84.88,22.19 84.9,22.12 84.9,22.06 84.9,20.77 84.9,20.7 84.88,20.64 84.85,20.58 84.81,20.53 84.76,20.49 84.7,20.46 84.64,20.44 84.57,20.44 84.09,20.44 84.03,20.44 83.96,20.46 83.91,20.49 83.86,20.53 83.82,20.58 83.79,20.64 83.77,20.7
N$20
  pour Bottom: 87.19,20.53 88.48,20.53 88.54,20.52 88.61,20.5 88.66,20.47 88.71,20.43 88.75,20.38 88.78,20.32 88.8,20.26 88.81,20.19 88.81,19.71 88.8,19.65 88.78,19.59 88.75,19.53 88.71,19.48 88.66,19.44 88.61,19.41 88.54,19.39 88.48,19.38 87.19,19.38 87.12,19.39 87.06,19.41 87,19.44 86.95,19.48 86.91,19.53 86.88,19.59 86.86,19.65 86.86,19.71 86.86,20.19 86.86,20.26 86.88,20.32 86.91,20.38 86.95,20.43 87,20.47 87.06,20.5 87.12,20.52
N$21
  pour Bottom: 91.84,20.53 93.13,20.53 93.2,20.52 93.26,20.5 93.32,20.47 93.37,20.43 93.41,20.38 93.44,20.32 93.46,20.26 93.46,20.19 93.46,19.71 93.46,19.65 93.44,19.59 93.41,19.53 93.37,19.48 93.32,19.44 93.26,19.41 93.2,19.39 93.13,19.38 91.84,19.38 91.78,19.39 91.71,19.41 91.66,19.44 91.61,19.48 91.57,19.53 91.54,19.59 91.52,19.65 91.51,19.71 91.51,20.19 91.52,20.26 91.54,20.32 91.57,20.38 91.61,20.43 91.66,20.47 91.71,20.5 91.78,20.52
N$22
  pour Bottom: 78.36,25.71 79.65,25.71 79.71,25.7 79.78,25.68 79.83,25.65 79.88,25.61 79.92,25.56 79.95,25.5 79.97,25.44 79.98,25.37 79.98,24.9 79.97,24.83 79.95,24.77 79.92,24.71 79.88,24.66 79.83,24.62 79.78,24.59 79.71,24.57 79.65,24.56 78.36,24.56 78.29,24.57 78.23,24.59 78.17,24.62 78.12,24.66 78.08,24.71 78.05,24.77 78.03,24.83 78.02,24.9 78.02,25.37 78.03,25.44 78.05,25.5 78.08,25.56 78.12,25.61 78.17,25.65 78.23,25.68 78.29,25.7
N$23
  pour Bottom: 68.87,25.84 70.16,25.84 70.23,25.83 70.29,25.81 70.35,25.78 70.39,25.74 70.44,25.69 70.47,25.63 70.49,25.57 70.49,25.5 70.49,25.03 70.49,24.96 70.47,24.9 70.44,24.84 70.39,24.79 70.35,24.75 70.29,24.72 70.23,24.7 70.16,24.69 68.87,24.69 68.8,24.7 68.74,24.72 68.69,24.75 68.64,24.79 68.6,24.84 68.56,24.9 68.55,24.96 68.54,25.03 68.54,25.5 68.55,25.57 68.56,25.63 68.6,25.69 68.64,25.74 68.69,25.78 68.74,25.81 68.8,25.83
N$24
  pour Bottom: 64.95,25.84 66.24,25.84 66.31,25.83 66.37,25.81 66.43,25.78 66.48,25.74 66.52,25.69 66.55,25.63 66.57,25.57 66.57,25.5 66.57,25.03 66.57,24.96 66.55,24.9 66.52,24.84 66.48,24.79 66.43,24.75 66.37,24.72 66.31,24.7 66.24,24.69 64.95,24.69 64.89,24.7 64.82,24.72 64.77,24.75 64.72,24.79 64.68,24.84 64.65,24.9 64.63,24.96 64.62,25.03 64.62,25.5 64.63,25.57 64.65,25.63 64.68,25.69 64.72,25.74 64.77,25.78 64.82,25.81 64.89,25.83
N$25
  pour Bottom: 31.52,16.35 41.5,22.53 42.01,22.82 42.74,23.03 43.62,23.16 44.59,23.21 45.57,23.18 46.5,23.05 47.32,22.84 47.96,22.53 58.05,16.23 58.41,15.9 58.64,15.51 58.77,15.07 58.78,14.61 58.71,14.16 58.56,13.73 58.34,13.34 58.06,13.03 49.78,7.76 48.71,7.05 47.57,6.51 46.38,6.16 45.13,5.99 43.85,6.03 42.53,6.28 41.2,6.75 39.87,7.45 31.22,12.93 30.83,13.23 30.55,13.62 30.37,14.06 30.32,14.55 30.4,15.04 30.62,15.52 30.99,15.97
RXD
  Top 0.203: U1.30 75.16,17.28 74.75,17.69 72.52,17.69 70.89,16.06 70.89,15.86 70.48,15.45 66.42,15.45 66.22,15.65 65.2,15.65 64.59,15.05 63.17,15.05 62.97,14.84 62.97,13.42 64.79,11.59 64.79,9.76 64.18,9.15 62.76,9.15 61.14,10.78 55.45,10.78 50.16,5.49 40.82,5.49 38.58,7.73 36.96,7.73 35.94,8.75 33.5,8.75 CONN1.3
S1  (via drill 0.51)
  Top 0.203: v84.91,14.64 84.3,14.03 U1.16 | v84.91,17.48 84.91,18.3 85.93,19.31 86.21,19.52
  Top 0.813: S1+.P$1 86.9,21.23 86.21,20.53 86.21,19.52
  Bottom 0.203: v84.91,17.48 v84.91,14.64
S2  (via drill 0.51)
  Top 0.203: S2+.P$1 64.03,26.55 63.98,26.5 v63.98,23.38 63.98,23.33 | v73.53,15.05 73.94,15.45 73.94,15.86 U1.32
  Bottom 0.203: v73.53,15.05 74.95,15.05 75.77,14.23 76.38,14.23 76.78,14.64 76.78,15.45 70.28,21.95 65.4,21.95 v63.98,23.38
S3
  Top 0.254: U1.12 86.21,7.27 86.21,6.64 90.47,6.64 92.25,8.42 U$1.S3
S5
  Top 0.254: U1.11 85.57,6.77 85.57,6.18 91.92,6.18 92.63,6.89 U$1.S5
  Top 0.305: 93.38,6.68 U$1.S5 92.56,6.89 92.56,6.56
S8@3.3V  (via drill 0.35)
  Top 0.152: R9.2 R10.1 67.98,20.57 67.98,20.06 70.98,20.06 71.73,19.26 72.67,19.26 v73.09,20.18 | U1.24 78.81,18.62 v78.81,18.47
  Bottom 0.152: v78.81,18.47 78.36,18.47 77.33,19.45 76.91,19.87 76.62,19.93 75.95,19.29 74.78,20.51 74.43,20.85 73.85,20.85 73.39,20.39 73.08,20.39 v73.09,20.18
S8@6V  (via drill 0.35)
  Top 0.152: R9.1 60.71,17.57 60.71,13.23 v63.98,9.99
  Top 0.254: U$1.S8 89.95,16.85 90.4,17.36 v90.65,17.61
  Bottom 0.152: 86.4,13.48 86.4,8.78 86.08,8.46 84.57,8.44 82.88,8.44 79.99,5.55 74.14,5.55 73.13,6.56 67.98,6.56 67.4,6.57 v63.98,9.99
  Bottom 0.254: v90.65,17.61 86.4,13.48
S9@3.3V  (via drill 0.35)
  Top 0.152: U1.23 80.72,19.05 80.36,18.69 80.36,18.11 79.86,17.61 v79.79,17.61 | v74.14,20.14 73.09,18.87 72.38,18.88 71.54,18.88 70.74,19.64 67.6,19.64 R6.1 R5.2
  Bottom 0.152: v79.79,17.61 79.74,17.66 77.34,17.03 74.85,19.52 v74.14,20.15 v74.14,20.14
S9@6V  (via drill 0.35)
  Top 0.152: 63.85,18.75 R5.1 63.44,19.07 62.87,19.07 61.07,17.29 61.07,13.54 62.71,11.9 v63.35,11.9 | v60.81,9.99 56.96,6.34 59.54,3.64 60.81,3.64 61.44,3.01 61.44,1.74 66.98,1.74 66.98,2.8 68.06,3.88 69.4,3.88 v70.05,4.5
  Top 0.254: U$1.S9 90.71,15.32 91.79,16.34 v91.79,16.4
  Bottom 0.152: 88.18,14.44 86.84,13.1 86.84,8.72 86.23,8.11 84.58,8.09 83.03,8.09 79.86,4.91 74.16,4.91 74.15,4.92 73.15,5.83 72.99,5.98 | 72.99,5.98 | 72.99,5.98 72.96,6.02 72.94,6.02 72.93,6.03 72.88,6.03 71.61,6.03 71.56,5.98 71.53,5.98 70.56,5 v70.05,4.5 | v60.81,9.99 62.71,11.9 v63.35,11.9
  Bottom 0.254: v91.79,16.4 90.08,16.34 88.18,14.44
SCL  (via drill 0.51)
  Top 0.203: v31.27,17.28 32.08,17.28 38.58,23.78 52.81,23.78 56.06,20.53 56.67,20.53 57.28,21.14 57.28,21.95 56.87,22.36 56.87,22.97 57.48,23.58 62.56,23.58 64.18,21.95 73.29,21.89 73.77,20.91 74.55,20.94 74.81,20.64 74.85,19.88 76.21,18.55 U1.28
  Bottom 0.203: v31.27,17.28 16.64,17.28 16.03,17.89 16.03,18.09 U3.6
SDA  (via drill 0.51)
  Top 0.203: v78.41,22.56 77.74,21.9 77.67,21.83 77.67,21.07 76.38,19.74 76.38,19.31 76.78,18.91 U1.27
  Bottom 0.203: v78.41,22.56 74.55,26.42 64.59,26.42 60.12,21.95 57.28,21.95 55.45,23.78 39.19,23.78 33.5,18.09 17.04,18.09 U3.4
SOL1  (via drill 0.35)
  Top 0.203: U1.9 79.22,10.86 v79.22,11.26 | v68.43,7.7 67.89,7.66 65.38,5.04 R1.1
  Bottom 0.203: 69.69,7.73 | 69.69,7.73 v68.43,7.7
  Bottom 0.254: v79.22,11.26 76.68,8.72 70.33,8.72 69.69,7.73
SOL1-  (via drill 0.35)
  Top 0.813: Q1.3 72.93,7.6 v72.93,7.64 | v79.22,8.09 79.86,7.45 79.86,4.3 SOL1.SOL1-
  Bottom 0.813: v72.93,7.64 76.87,7.64 77.95,8.09 v79.22,8.09
SOL2  (via drill 0.51)
  Top 0.203: v67.44,24.6 66.22,23.38 R3.1 | v82.68,14.44 83.69,13.42 U1.15
  Bottom 0.203: v67.44,24.6 68.05,24.6 70.28,22.36 76.17,22.36 82.68,15.86 v82.68,14.44
SOL2-
  Top 0.203: 76.58,25.23 76.58,22.77 Q2.3
  Top 0.813: SOL2-.P$1 77.19,26.25 76.68,25.23 76.58,25.23 D1.A
TXD  (via drill 0.51)
  Top 0.203: v72.92,16.87 73.13,17.08 74.14,17.08 74.55,16.67 U1.31
  Bottom 0.203: v72.92,16.87 69.47,20.33 61.14,20.33 59.31,18.5 59.31,13.42 51.38,5.49 40.82,5.49 38.58,7.73 36.96,7.73 34.72,9.97 31.27,9.97 CONN1.2

### Text on the board
Dimension: CUT OUT | CUT OUT | CUT OUT | CUT OUT | CUT OUT | CUT OUT | CUT OUT | CUT OUT